# EAGLE design LDR darlington motor driver (EAGLE 5.11)
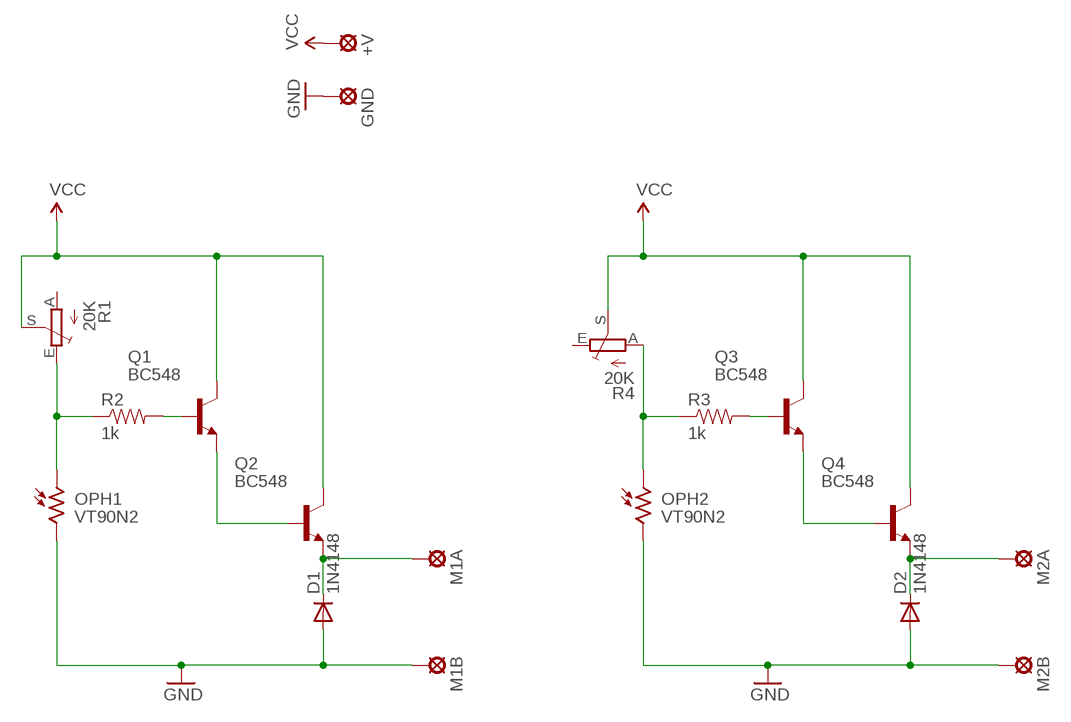
[diagram p0: schematic, sheet 1]

## Parts
+V  SE14  [SE14]
D1  1N4148  DIODE1N4148  [DIODE-1N4148]
D2  1N4148  DIODE1N4148  [DIODE-1N4148]
GND  SE14  [SE14]
M1A  SE14  [SE14]
M1B  SE14  [SE14]
M2A  SE14  [SE14]
M2B  SE14  [SE14]
OPH1  VT90N2  [VT900]
OPH2  VT90N2  [VT900]
Q1  BC548  [TO92-EBC]
Q2  BC548  [TO92-EBC]
Q3  BC548  [TO92-EBC]
Q4  BC548  [TO92-EBC]
R1  20K  TRIM_EU-PT10  [PT-10]
R2  1k  RESISTORPTH1  [AXIAL-0.3]
R3  1k  RESISTORPTH1  [AXIAL-0.3]
R4  20K  TRIM_EU-PT10  [PT-10]

## Nets
GND: D1.A D2.A GND.MP M1B.MP M2B.MP OPH1.2 OPH2.2
N$1: Q1.E Q2.B
N$2: OPH1.1 R1.E R2.P$1
N$3: Q1.B R2.P$2
N$4: D1.C M1A.MP Q2.E
N$5: Q3.E Q4.B
N$6: OPH2.1 R3.P$1 R4.A
N$7: Q3.B R3.P$2
N$8: D2.C M2A.MP Q4.E
VCC: +V.MP Q1.C Q2.C Q3.C Q4.C R1.S R4.S
Unconnected: R1.A R4.E

## Library data of the parts
+V GND M1A M1B M2A M2B = solpad:SE14: SOLDER PAD E1553, drill 1,4mm, distributor Buerklin, 07F820
D1 D2 = SparkFun:DIODE: Diode These are standard reverse protection diodes and small signal diodes. SMA package can handle up to about 1A. SOD-323 can handle about 200mA. What the SOD-323 package when ordering, there are some mfgs out there that are 5-pin packages.
OPH1 OPH2 = photo-elements:VT9: Photoconductive Cell VT900 Series Source: http://optoelectronics.perkinelmer.com/content/Datasheets/DTS_vt900seriesdatasheet.pdf
Q1-Q4 = transistor-npn:BC548*: NPN Transistor
R1 R4 = pot:TRIM_EU-: POTENTIOMETER
R2 R3 = SparkFun:RESISTOR: Resistor Basic schematic elements and footprints for 0603, 1206, and PTH 1/10th watt (small) resistors.

## Board
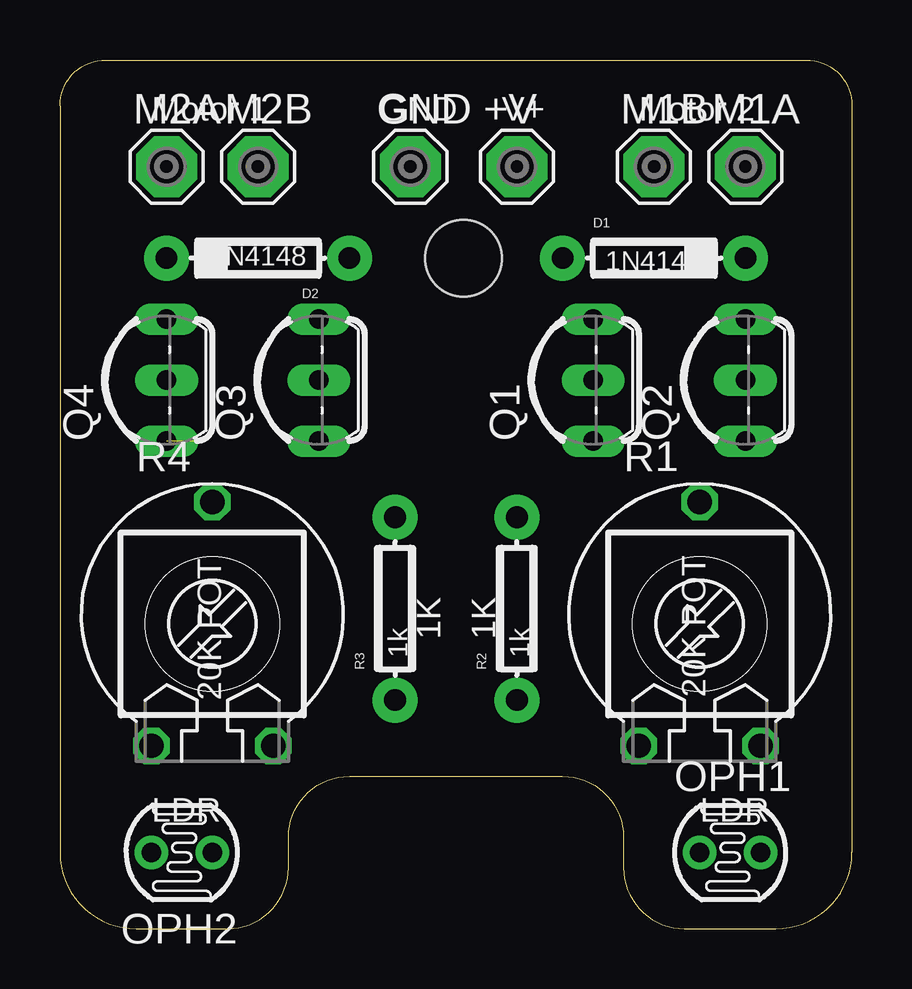
[diagram p1: board, top side]
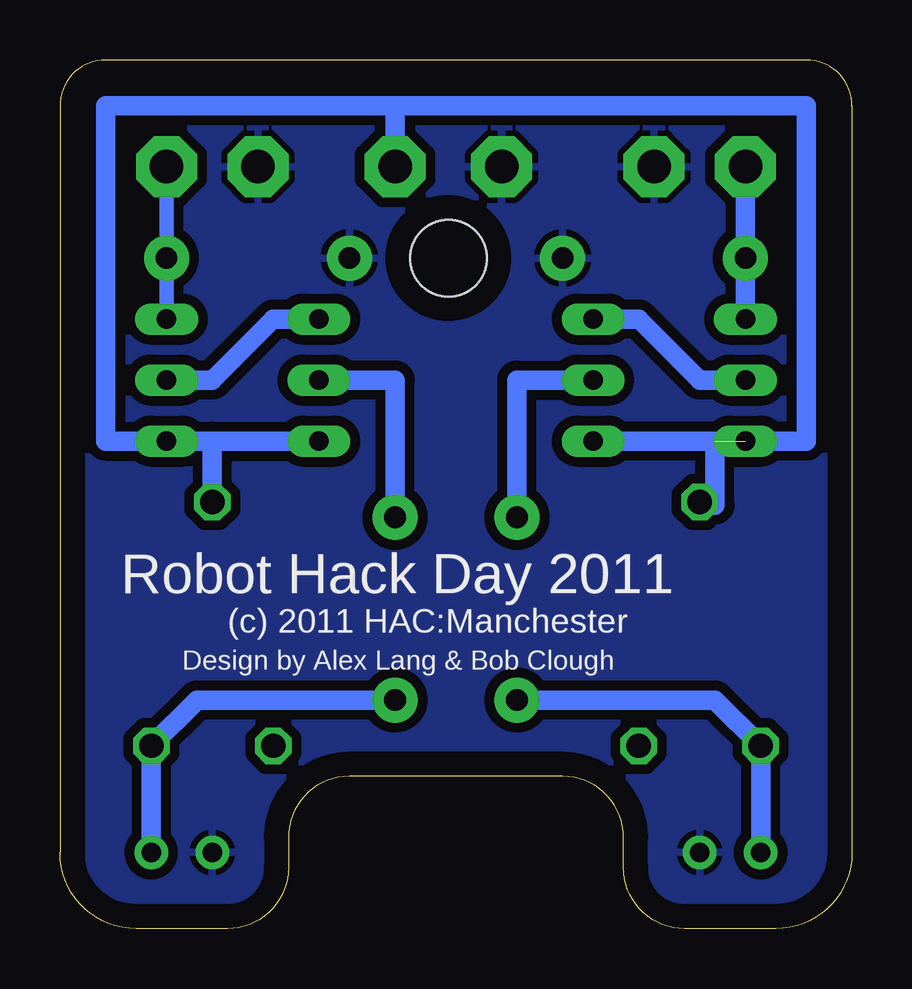
[diagram p2: board, bottom side, seen from below]

Size 33.02 x 36.2 mm. Coordinates in mm from the lower left corner, seen from the top.
Outline: 0,34.29 arc-90 1.91,36.2 31.11,36.2 arc-90 33.02,34.29 33.02,3.18 arc-90 29.85,0 26.04,0 arc-90 23.5,2.54 23.5,3.81 arc90 20.95,6.35 12.07,6.35 arc90 9.52,3.81 9.52,2.54 arc-90 6.99,0 3.17,0 arc-90 0,3.18 0,34.29
Copper layers (1*16): Top 0.035mm / dielectric 1.5mm / Bottom 0.035mm
Design rules "default": minimum track width 10mil, minimum drill 24mil, track to track 8mil, track to pad 8mil, pad to pad 8mil, via to via 8mil, smd to smd 8mil, copper to edge 40mil, drill to drill 8mil, minimum pad ring 10mil, minimum via ring 8mil, stop-mask expansion 4mil, vias tented up to drill 0mil, thermal gap 10mil
Holes 3.2 mm at 16.83,27.94

### Footprints (pad centres in the part's own frame; a part is rotated, then mirrored left to right if it is on the bottom)
SE14 = drill 1.397 pad 2.54 octagon: MP 0,0
DIODE-1N4148 = drill 0.9 pad 1.88 round: A -3.81,0; C 3.81,0
VT900 = drill 0.8 pad 1.4 round: 1 -1.27,0; 2 1.27,0
TO92-EBC = drill 0.813 long: B 0,-1.27; C -2.54,-1.27; E 2.54,-1.27
PT-10 = drill 1.016 octagon: A -2.54,-5.08; E 2.54,-5.08; S 0,5.08
AXIAL-0.3 = drill 0.9 pad 1.88 round: P$1 -3.81,0; P$2 3.81,0

### Placement (x,y rotation side)
+V  19.05,31.75 0 top
D1  24.77,27.94 0 top
D2  8.25,27.94 180 top
GND  14.61,31.75 0 top
M1A  28.57,31.75 0 top
M1B  24.77,31.75 0 top
M2A  4.45,31.75 0 top
M2B  8.25,31.75 0 top
OPH1  27.94,3.18 180 top
OPH2  5.08,3.18 0 top
Q1  20.95,22.86 90 top
Q2  27.3,22.86 90 top
Q3  9.52,22.86 90 top
Q4  3.17,22.86 90 top
R1  26.67,12.7 0 top
R2  19.05,13.34 90 top
R3  13.97,13.34 90 top
R4  6.35,12.7 0 top

### Tracks (layer width: path | path; a pad name or v marks a point on that pad's centre or on a via)
GND
  pour Bottom (isolate 0.406): -4.45,41.91 50.17,41.91 50.17,-15.24 -9.52,-15.24 -9.52,41.91
N$1
  Bottom 0.813: Q1.E 24.13,25.4 26.67,22.86 Q2.B
N$2
  Bottom 0.813: R2.P$1 27.3,9.52 R1.E OPH1.1
N$3
  Bottom 0.813: Q1.B 19.05,22.86 R2.P$2
N$4
  Bottom 0.61: Q2.E D1.C M1A.MP
N$5
  Bottom 0.813: Q4.B 6.35,22.86 8.89,25.4 Q3.E
N$6
  Bottom 0.813: R3.P$1 5.72,9.52 R4.A OPH2.1
N$7
  Bottom 0.813: Q3.B 13.97,22.86 R3.P$2
N$8
  Bottom 0.813: Q4.E D2.C M2A.MP
VCC  (1 unrouted)
  Bottom 0.813: 19.05,34.29 +V.MP | 19.05,34.29 1.91,34.29 1.91,20.32 Q4.C Q3.C | 19.05,34.29 31.11,34.29 31.11,20.32 Q2.C 26.67,20.32 | R4.S 5.72,17.65 5.72,20.32 | 26.67,20.32 Q1.C | 26.67,20.32 R1.S

### Text on the board
_tsilk: Motor 1 | GND | V+ | Motor 2 | 1K | 1K | 20K POT | 20K POT | LDR | LDR
_bsilk: Robot Hack Day 2011 | (c) 2011 HAC:Manchester | Design by Alex Lang & Bob Clough